# Altium project Industrial Instrumentation Controller.PrjPcb
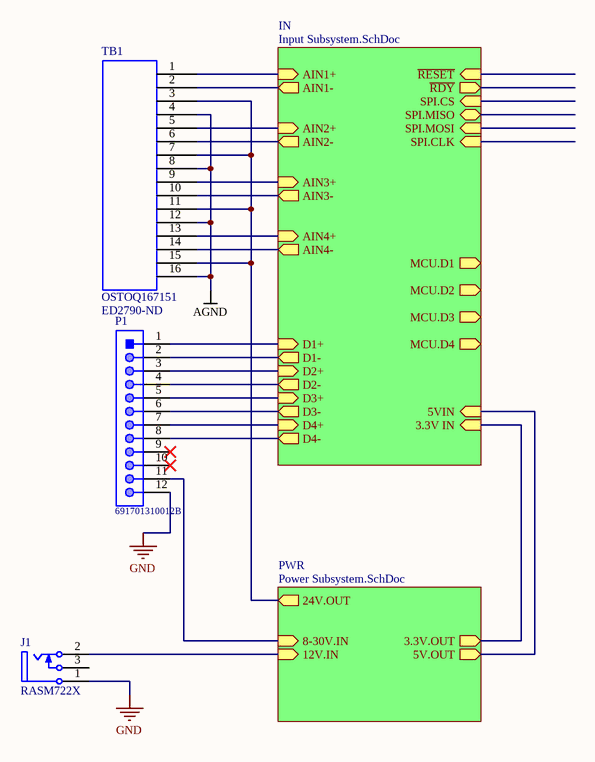
[diagram p0: Industrial Instrumentation Controller.SchDoc]
7 sheets, 128 parts. Net scope: hierarchical (ports join the sheet entries above them; power ports are global).
Board files: PCBSM.PcbDoc, 0PCBSM.PcbDoc
Sheets:
  Industrial Instrumentation Controller.SchDoc
    IN = Input Subsystem.SchDoc
      CH1 = CurrentSensingSM.SchDoc
      CH2 = CurrentSensingSM.SchDoc
      CH3 = CurrentSensingSM.SchDoc
      CH4 = CurrentSensingSM.SchDoc
    PWR = Power Subsystem.SchDoc
      U_24VBuckBoostConverterSM = 24VBuckBoostConverterSM.SchDoc
      U_3.3VBuckConverterSM = 3.3VBuckConverterSM.SchDoc
      U_5VBuckConverterSM = 5VBuckConverterSM.SchDoc

## Sheet Industrial Instrumentation Controller.SchDoc
size A; SheetNumber: 1; SheetTotal: 7

### Parts
J1  RASM722X  [SWIT-RASM722X_V]
P1  691701310012B  [691701310012B]
TB1  OSTOQ167151  Supplier Part Number 1: ED2790-ND  [OSTOQ167151]

### Sub-sheets
IN = Input Subsystem.SchDoc: SPI.CLK (in), SPI.MOSI (in), SPI.MISO (bidir), SPI.CS (in), ~{RDY} (out), ~{RESET} (in), 3.3V IN (in), AIN1+ (in), AIN1- (out), AIN2+ (in), AIN2- (out), AIN3+ (in), AIN3- (out), AIN4+ (in), AIN4- (out), 5VIN (in), D1+ (in), D2+ (in), D3+ (in), D4+ (in), MCU.D1 (out), MCU.D2 (out), MCU.D3 (out), MCU.D4 (out), D1- (out), D2- (out), D3- (out), D4- (out)
PWR = Power Subsystem.SchDoc: 12V.IN (in), 8-30V.IN (in), 5V.OUT (out), 3.3V.OUT (out), 24V.OUT (out)

### Nets
3.3V: sheet IN/3.3V IN, sheet PWR/3.3V.OUT
24V: TB1.3 TB1.7 TB1.11 TB1.15 ; sheet PWR/24V.OUT
AGND: TB1.4 TB1.8 TB1.12 TB1.16
GND: J1.1(SLEEVE) P1.12
NetC3_1: sheet IN/5VIN, sheet PWR/5V.OUT
NetC20_CH1_2: TB1.2 ; sheet IN/AIN1-
NetC20_CH2_2: TB1.6 ; sheet IN/AIN2-
NetC20_CH3_2: TB1.10 ; sheet IN/AIN3-
NetC20_CH4_2: TB1.14 ; sheet IN/AIN4-
NetD1_2: J1.2(TIP) ; sheet PWR/12V.IN
NetD2_2: P1.11 ; sheet PWR/8-30V.IN
NetF1_CH1_1: TB1.1 ; sheet IN/AIN1+
NetF1_CH2_1: TB1.5 ; sheet IN/AIN2+
NetF1_CH3_1: TB1.9 ; sheet IN/AIN3+
NetF1_CH4_1: TB1.13 ; sheet IN/AIN4+
NetP1_1: P1.1 ; sheet IN/D1+
NetP1_2: P1.2 ; sheet IN/D1-
NetP1_3: P1.3 ; sheet IN/D2+
NetP1_4: P1.4 ; sheet IN/D2-
NetP1_5: P1.5 ; sheet IN/D3+
NetP1_6: P1.6 ; sheet IN/D3-
NetP1_7: P1.7 ; sheet IN/D4+
NetP1_8: P1.8 ; sheet IN/D4-

Not connected (* = marked no-connect by the designer): J1 3(SHUNT); P1 9* 10*

### Library data of the parts
J1 = CMP-1772-00002-1: Power Jack, 5 A, 250 V, 3-Pin SMD, RoHS, Bulk; ComponentLink1URL: http://www.switchcraft.com/; ComponentLink2URL: http://www.switchcraft.com/Drawings/rasm732x_cd.pdf; ComponentLink1Description: Manufacturer URL; PackageReference: RASM722X; ComponentLink2Description: Datasheet; DatasheetVersion: Rev. A, 09/2005; PackageDescription: 3-Pin Surface Mount Device, Body 14.5 x 9 mm
P1 = CMP-1502-01991-1: Serie 7013 B - 3.81mm Vertical PCB Header THR Type WR-TBL, 12 pin; Manufacturer: Wurth Elektronik; Gender: Male; Pin Number: 12; Mounting Technology: SMT; Publisher: WurthElektronik; Operating Temperature: -40to105degC; Pitch: 3.81mm; Package Reference: 691701310012B; Packaging: Box; Manufacturer URL: http://www.we-online.de; Datasheet URL: http://katalog.we-online.de/em/datasheet/6917013100xxB.pdf; Part Number: 691701310012B
TB1 = OSTOQ167151: Supplier 1: Digi-Key

## Sheet Input Subsystem.SchDoc
size A; SheetNumber: 6; SheetTotal: 7
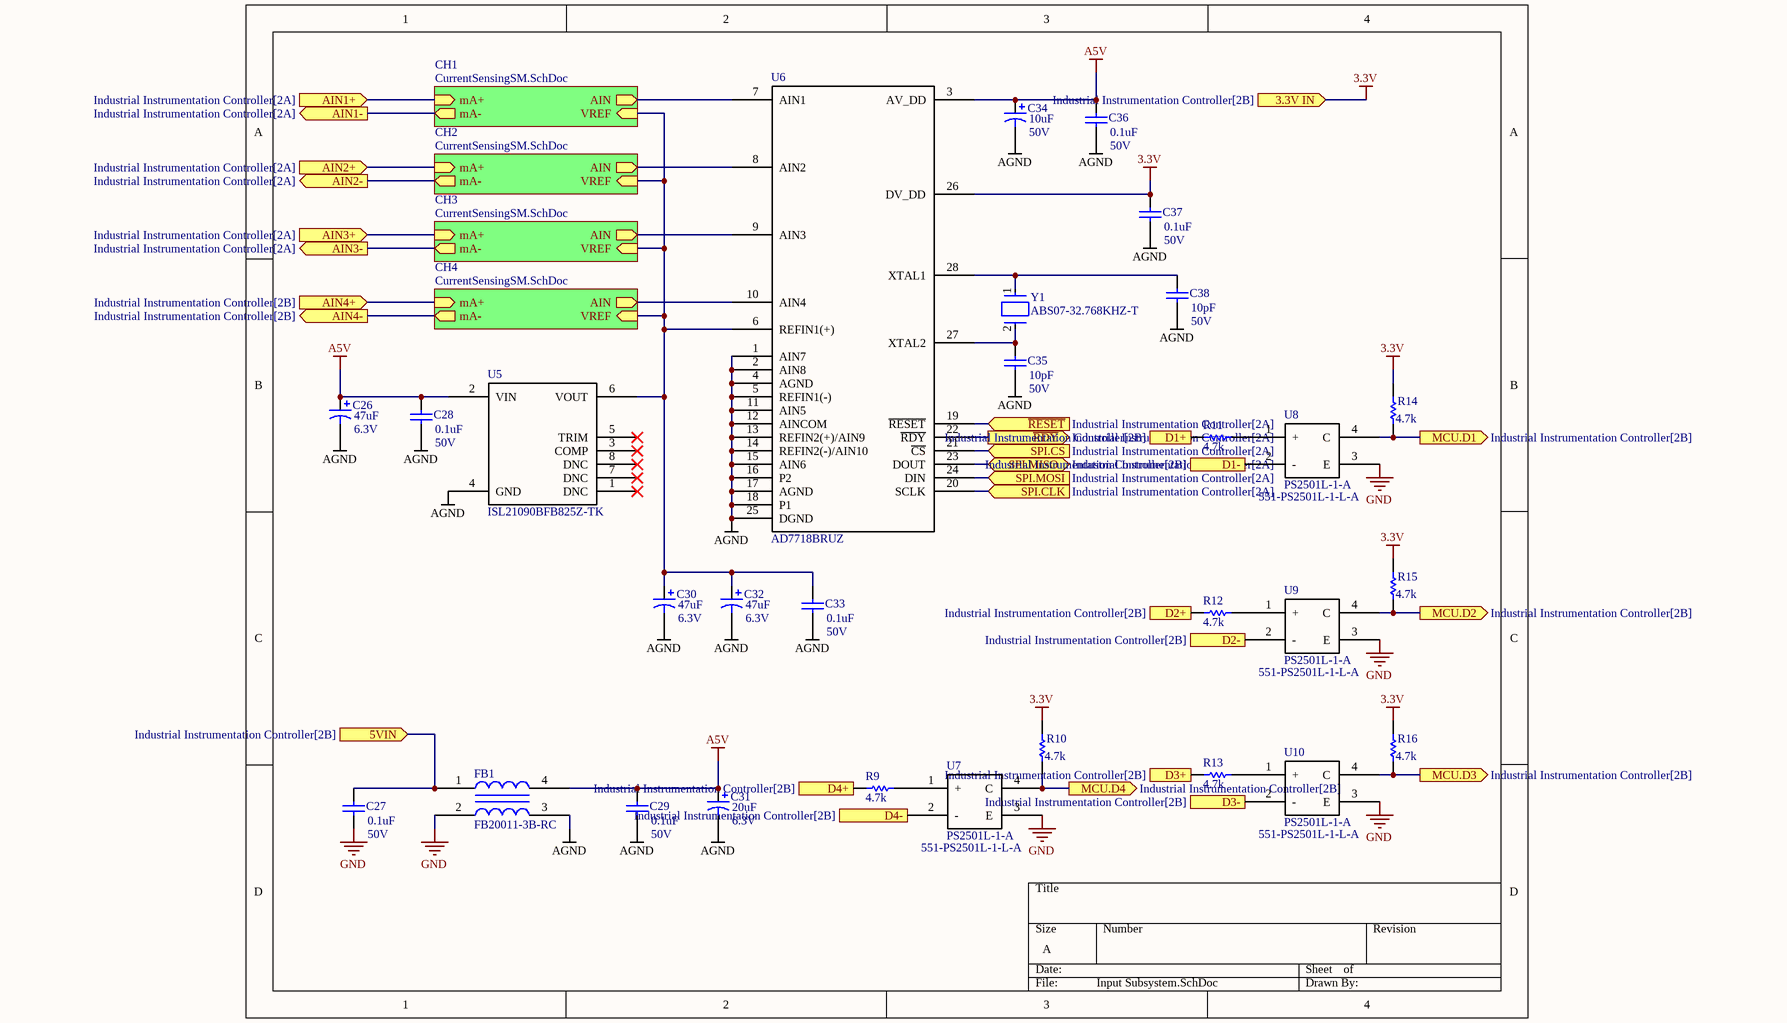
[diagram p1: Input Subsystem.SchDoc]

### Parts
C26  value 47uF  Voltage Rating: 6.3V  [RB7.6-15]  (hidden comment: Cap Pol1)
C27  value 0.1uF  Voltage Rating: 50V  [RAD-0.3]  (hidden comment: Cap)
C28  value 0.1uF  Voltage Rating: 50V  [RAD-0.3]  (hidden comment: Cap)
C29  value 0.1uF  Voltage Rating: 50V  [RAD-0.3]  (hidden comment: Cap)
C30  value 47uF  Voltage Rating: 6.3V  [RB7.6-15]  (hidden comment: Cap Pol1)
C31  value 20uF  Voltage Rating: 6.3V  [RB7.6-15]  (hidden comment: Cap Pol1)
C32  value 47uF  Voltage Rating: 6.3V  [RB7.6-15]  (hidden comment: Cap Pol1)
C33  value 0.1uF  Voltage Rating: 50V  [RAD-0.3]  (hidden comment: Cap)
C34  value 10uF  Voltage Rating: 50V  [RB7.6-15]  (hidden comment: Cap Pol1)
C35  value 10pF  Voltage Rating: 50V  [RAD-0.3]  (hidden comment: Cap)
C36  value 0.1uF  Voltage Rating: 50V  [RAD-0.3]  (hidden comment: Cap)
C37  value 0.1uF  Voltage Rating: 50V  [RAD-0.3]  (hidden comment: Cap)
C38  value 10pF  Voltage Rating: 50V  [RAD-0.3]  (hidden comment: Cap)
FB1  FB20011-3B-RC  [FB20011]
R9  value 4.7k  [AXIAL-0.3]  (hidden comment: Res1)
R10  value 4.7k  [AXIAL-0.3]  (hidden comment: Res1)
R11  value 4.7k  [AXIAL-0.3]  (hidden comment: Res1)
R12  value 4.7k  [AXIAL-0.3]  (hidden comment: Res1)
R13  value 4.7k  [AXIAL-0.3]  (hidden comment: Res1)
R14  value 4.7k  [AXIAL-0.3]  (hidden comment: Res1)
R15  value 4.7k  [AXIAL-0.3]  (hidden comment: Res1)
R16  value 4.7k  [AXIAL-0.3]  (hidden comment: Res1)
U5  ISL21090BFB825Z-TK  [ISL21090BFB825Z-TK]
U6  AD7718BRUZ  [AD7718BRUZ]
U7  PS2501L-1-A  Supplier Part Number 1: 551-PS2501L-1-L-A  [PS2501L-1-A]
U8  PS2501L-1-A  Supplier Part Number 1: 551-PS2501L-1-L-A  [PS2501L-1-A]
U9  PS2501L-1-A  Supplier Part Number 1: 551-PS2501L-1-L-A  [PS2501L-1-A]
U10  PS2501L-1-A  Supplier Part Number 1: 551-PS2501L-1-L-A  [PS2501L-1-A]
Y1  ABS07-32.768KHZ-T  [FP-ABS07-MFG]

### Sub-sheets
CH1 = CurrentSensingSM.SchDoc: mA+ (in), mA- (out), AIN (out), VREF (in)
CH2 = CurrentSensingSM.SchDoc: mA+ (in), mA- (out), AIN (out), VREF (in)
CH3 = CurrentSensingSM.SchDoc: mA+ (in), mA- (out), AIN (out), VREF (in)
CH4 = CurrentSensingSM.SchDoc: mA+ (in), mA- (out), AIN (out), VREF (in)

### Ports
3.3V IN (in, see Industrial Instrumentation Controller[2B]), 5VIN (in, see Industrial Instrumentation Controller[2B]), AIN1+ (in, see Industrial Instrumentation Controller[2A]), AIN1- (out, see Industrial Instrumentation Controller[2A]), AIN2+ (in, see Industrial Instrumentation Controller[2A]), AIN2- (out, see Industrial Instrumentation Controller[2A]), AIN3+ (in, see Industrial Instrumentation Controller[2A]), AIN3- (out, see Industrial Instrumentation Controller[2A]), AIN4+ (in, see Industrial Instrumentation Controller[2B]), AIN4- (out, see Industrial Instrumentation Controller[2B]), D1+ (in, see Industrial Instrumentation Controller[2B]), D1- (out, see Industrial Instrumentation Controller[2B]), D2+ (in, see Industrial Instrumentation Controller[2B]), D2- (out, see Industrial Instrumentation Controller[2B]), D3+ (in, see Industrial Instrumentation Controller[2B]), D3- (out, see Industrial Instrumentation Controller[2B]), D4+ (in, see Industrial Instrumentation Controller[2B]), D4- (out, see Industrial Instrumentation Controller[2B]), MCU.D1 (out, see Industrial Instrumentation Controller[2B]), MCU.D2 (out, see Industrial Instrumentation Controller[2B]), MCU.D3 (out, see Industrial Instrumentation Controller[2B]), MCU.D4 (out, see Industrial Instrumentation Controller[2B]), SPI.CLK (in, see Industrial Instrumentation Controller[2A]), SPI.CS (in, see Industrial Instrumentation Controller[2A]), SPI.MISO (bidir, see Industrial Instrumentation Controller[2A]), SPI.MOSI (in, see Industrial Instrumentation Controller[2A]), ~{RDY} (out, see Industrial Instrumentation Controller[2A]), ~{RESET} (in, see Industrial Instrumentation Controller[2A])

### Nets
3.3V: C37.2 R10.2 R14.2 R15.2 R16.2 U6.26(DV_DD) ; port 3.3V IN
A5V: C26.1 C28.2 C29.2 C31.1 C34.1 C36.2 FB1.4(A5V) U5.2(VIN) U6.3(AV_DD)
AGND: C26.2 C28.1 C29.1 C30.2 C31.2 C32.2 C33.1 C34.2 C35.1 C36.1 C37.1 C38.1 FB1.3(AGND) U5.4(GND) U6.1(AIN7) U6.2(AIN8) U6.4(AGND) U6.5(REFIN1(-)) U6.11(AIN5) U6.12(AINCOM) U6.13(REFIN2(+)/AIN9) U6.14(REFIN2(-)/AIN10) U6.15(AIN6) U6.16(P2) U6.17(AGND) U6.18(P1) U6.25(DGND)
GND: C27.1 FB1.2(GND) U7.3(E) U8.3(E) U9.3(E) U10.3(E)
NetC3_1: C27.2 FB1.1(5V) ; port 5VIN
NetC20_CH1_2: port AIN1-, sheet CH1/mA-
NetC20_CH2_2: port AIN2-, sheet CH2/mA-
NetC20_CH3_2: port AIN3-, sheet CH3/mA-
NetC20_CH4_2: port AIN4-, sheet CH4/mA-
NetC22_CH1_2: C30.1 C32.1 C33.2 U5.6(VOUT) U6.6(REFIN1(+)) ; sheet CH1/VREF, sheet CH2/VREF, sheet CH3/VREF, sheet CH4/VREF
NetC24_CH1_2: U6.7(AIN1) ; sheet CH1/AIN
NetC24_CH2_2: U6.8(AIN2) ; sheet CH2/AIN
NetC24_CH3_2: U6.9(AIN3) ; sheet CH3/AIN
NetC24_CH4_2: U6.10(AIN4) ; sheet CH4/AIN
NetC35_2: C35.2 U6.27(XTAL2) Y1.2
NetC38_2: C38.2 U6.28(XTAL1) Y1.1
NetF1_CH1_1: port AIN1+, sheet CH1/mA+
NetF1_CH2_1: port AIN2+, sheet CH2/mA+
NetF1_CH3_1: port AIN3+, sheet CH3/mA+
NetF1_CH4_1: port AIN4+, sheet CH4/mA+
NetP1_1: R11.2 ; port D1+
NetP1_2: U8.2(-) ; port D1-
NetP1_3: R12.2 ; port D2+
NetP1_4: U9.2(-) ; port D2-
NetP1_5: R13.2 ; port D3+
NetP1_6: U10.2(-) ; port D3-
NetP1_7: R9.2 ; port D4+
NetP1_8: U7.2(-) ; port D4-
NetR9_1: R9.1 U7.1(+)
NetR10_1: R10.1 U7.4(C) ; port MCU.D4
NetR11_1: R11.1 U8.1(+)
NetR12_1: R12.1 U9.1(+)
NetR13_1: R13.1 U10.1(+)
NetR14_1: R14.1 U8.4(C) ; port MCU.D1
NetR15_1: R15.1 U9.4(C) ; port MCU.D2
NetR16_1: R16.1 U10.4(C) ; port MCU.D3
NetU6_19: U6.19(~{RESET}) ; port ~{RESET}
NetU6_20: U6.20(SCLK) ; port SPI.CLK
NetU6_21: U6.21(~{CS}) ; port SPI.CS
NetU6_22: U6.22(~{RDY}) ; port ~{RDY}
NetU6_23: U6.23(DOUT) ; port SPI.MISO
NetU6_24: U6.24(DIN) ; port SPI.MOSI

Not connected (* = marked no-connect by the designer): U5 1(DNC)* 3(COMP)* 5(TRIM)* 7(DNC)* 8(DNC)*

### Library data of the parts
C26 C30-C32 C34 = Cap Pol1: Polarized Capacitor (Radial); Published: 8-Jun-2000; LatestRevisionDate: 17-Jul-2002; LatestRevisionNote: Re-released for DXP Platform.; PackageReference: RB7.6-15; Publisher: Altium Limited; PackageDescription: Polarized Capacitor (Radial); 2 Leads
C27-C29 C33 C35-C38 = Cap: Capacitor; Published: 8-Jun-2000; LatestRevisionDate: 17-Jul-2002; LatestRevisionNote: Re-released for DXP Platform.; PackageReference: RAD-0.3; Publisher: Altium Limited; PackageDescription: Radial Cap, Thru-Hole; 2 Leads; 0.3 in Pin Spacing
FB1 = FB20011
R9-R16 = Res1: Resistor; Published: 8-Jun-2000; LatestRevisionDate: 17-Jul-2002; LatestRevisionNote: Re-released for DXP Platform.; PackageReference: AXIAL-0.3; Publisher: Altium Limited; PackageDescription: Axial Device, Thru-Hole; 2 Leads; 0.3 in Pin Spacing
U7-U10 = PS2501L-1-A: Optocoupler DC-IN 1-CH Transistor DC-OUT 4-Pin PDIP SMD Magazine; Manufacturer: CEL; Manufacturer Part Number: PS2501L-1-L-A; Collector Emitter Voltage (VCEO): 300mV; Input Type: DC; Current Transfer Ratio: 300%; Number of Channels: 1; Max Power Dissipation: 150mW; Forward Current: 10mA; Max Collector Current: 50mA; Isolation Voltage: 5kV; Output Voltage: 80V; Supplier 1: Mouser; RoHS: Yes; Category: Optocouplers; Mount: Surface Mount; Case/Package: SMD/SMT; Min Operating Temperature: -55°C; Max Operating Temperature: 100°C; Packaging: Rail/Tube; Collector Emitter Saturation Voltage: 300mV; Package Quantity: 100; Output Current per Channel: 50mA; Series: NEPOC; Collector-emitter Voltage-Max: 300mV; Lead Free: Lead Free; ComponentLink1URL: https://datasheet.ciiva.com/2088/ps2501-2088124.pdf?src-supplier=Digi-Key; ComponentLink1Description: https://datasheet.ciiva.com/2088/ps2501-2088124.pdf?src-supplier=Digi-Key
Y1 = CMP-0447-00001-4: Crystal 32.768kHz ±20ppm (Tol) 12.5pF FUND 70kΩ 2-Pin CSMD T/R; ESR (Equivalent Series Resistance): 70kR; Radiation Hardening: No; Frequency: 32.768kHz; Length: 3.2mm; Max Operating Temperature: 85°C; Number of Pins: 2; Series: ABS07; Min Operating Temperature: -40°C; Frequency Tolerance: 20ppm; Packaging: Tape and Reel; Height: 0.9mm; Width: 1.5mm; Depth: 1.5mm; Load Capacitance: 12.5pF; RoHS Compliant: Yes; Tolerance: 20ppm; Termination: SMD/SMT; Lead Free: Lead Free; Series Resistance: 70kR; REACH SVHC: No SVHC; Case/Package: CSMD; Operating Frequency: 32.768 kHz; Package Quantity: 3000

## Sheet CurrentSensingSM.SchDoc
size A; SheetNumber: 7; SheetTotal: 7
Used 4 times, as channels IN/CH1, IN/CH2, IN/CH3, IN/CH4. Parts and nets are listed once, with the designators drawn on the sheet.
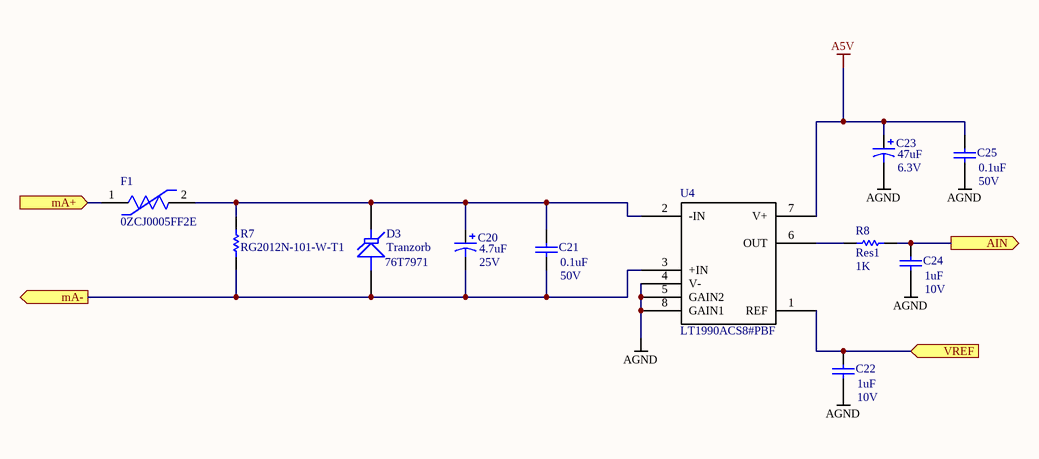
[diagram p2: CurrentSensingSM.SchDoc]

### Parts
C20  value 4.7uF  Voltage Rating: 25V  [RB7.6-15]  (hidden comment: Cap Pol1)
C21  value 0.1uF  Voltage Rating: 50V  [RAD-0.3]  (hidden comment: Cap)
C22  value 1uF  Voltage Rating: 10V  [RAD-0.3]  (hidden comment: Cap)
C23  value 47uF  Voltage Rating: 6.3V  [RB7.6-15]  (hidden comment: Cap Pol1)
C24  value 1uF  Voltage Rating: 10V  [RAD-0.3]  (hidden comment: Cap)
C25  value 0.1uF  Voltage Rating: 50V  [RAD-0.3]  (hidden comment: Cap)
D3  Tranzorb  Supplier Part Number 1: 76T7971  [SZ1SMB36CAT3G]
F1  0ZCJ0005FF2E  [FP-0ZCJ0005FF2E-MFG]
R7  RG2012N-101-W-T1  [RESC2013X50X40ML20T20]
R8  Res1  value 1K  [AXIAL-0.3]
U4  LT1990ACS8#PBF  [LT1990ACS8-PBF]

### Ports
AIN (out), mA+ (in), mA- (out), VREF (in)

### Nets
A5V: C23.1 C25.2 U4.7(V+)
AGND: C22.1 C23.2 C24.1 C25.1 U4.4(V-) U4.5(GAIN2) U4.8(GAIN1)
AIN: C24.2 R8.2 ; port AIN
mA+: F1.1 ; port mA+
mA-: C20.2 C21.1 D3.1(A) R7.1 U4.3(+IN) ; port mA-
VREF: C22.2 U4.1(REF) ; port VREF
NetC20_1: C20.1 C21.2 D3.2(K) F1.2 R7.2 U4.2(-IN)
NetR8_1: R8.1 U4.6(OUT)

### Channels
IN/CH1: designators end in _CH1; ports AIN=NetC24_CH1_2 mA+=NetF1_CH1_1 mA-=NetC20_CH1_2 VREF=NetC22_CH1_2
IN/CH2: designators end in _CH2; ports AIN=NetC24_CH2_2 mA+=NetF1_CH2_1 mA-=NetC20_CH2_2 VREF=NetC22_CH1_2
IN/CH3: designators end in _CH3; ports AIN=NetC24_CH3_2 mA+=NetF1_CH3_1 mA-=NetC20_CH3_2 VREF=NetC22_CH1_2
IN/CH4: designators end in _CH4; ports AIN=NetC24_CH4_2 mA+=NetF1_CH4_1 mA-=NetC20_CH4_2 VREF=NetC22_CH1_2

### Library data of the parts
C20 C23 = Cap Pol1: Polarized Capacitor (Radial); Published: 8-Jun-2000; LatestRevisionDate: 17-Jul-2002; LatestRevisionNote: Re-released for DXP Platform.; PackageReference: RB7.6-15; Publisher: Altium Limited; PackageDescription: Polarized Capacitor (Radial); 2 Leads
C21 C22 C24 C25 = Cap: Capacitor; Published: 8-Jun-2000; LatestRevisionDate: 17-Jul-2002; LatestRevisionNote: Re-released for DXP Platform.; PackageReference: RAD-0.3; Publisher: Altium Limited; PackageDescription: Radial Cap, Thru-Hole; 2 Leads; 0.3 in Pin Spacing
D3 = Tranzorb: 1SMB Series 600 W 36 V Bi-Directional Surface Mount TVS Diode - DO-214AA; Manufacturer: ON Semiconductor; Direction: Bidirectional; Reverse Breakdown Voltage: 40V; Number of Bidirectional Channels: 1; Reverse Standoff Voltage: 36V; Clamping Voltage: 58.1V; Peak Pulse Power: 600W; Power Line Protection: No; Peak Pulse Current: 10.3A; Test Current: 1mA; ESD Protection: Yes; Max Reverse Leakage Current: 5uA; Element Configuration: Single; Diode Type: ZENER; Published: 24-Mar-1999; LatestRevisionDate: 17-Jul-2002; LatestRevisionNote: Re-released for DXP Platform.; PackageReference: DO-7; Publisher: Altium Limited; PackageDescription: Axial Lead Diode; Supplier 1: Newark; Manufacturer Part Number: SZ1SMB36CAT3G; RoHS: Yes; Category: TVS Diodes; Mount: Surface Mount; Case/Package: SMB; Number of Pins: 2; Min Operating Temperature: -65°C; Max Operating Temperature: 150°C; Packaging: Tape and Reel; Package Quantity: 2500; Min Breakdown Voltage: 40V; Polarity: Bidirectional; Number of Elements: 1; Max Power Dissipation: 600W; Leakage Current: 5uA; Breakdown Voltage: 40V; Resistor Type: Zener; Series: Automotive, AEC-Q101; Length: 4.57mm; Width: 3.81mm; Height: 2.41mm; RoHS Compliant: Yes; Lead Free: Lead Free; ComponentLink1URL: https://datasheet.ciiva.com/11313/1smb10cat3-d-11313549.pdf?src-supplier=Avnet; ComponentLink1Description: https://datasheet.ciiva.com/11313/1smb10cat3-d-11313549.pdf?src-supplier=Avnet; ComponentLink2URL: https://datasheet.ciiva.com/354/1smb10cat3-d-354502.pdf?src-supplier=Digi-Key; ComponentLink2Description: https://datasheet.ciiva.com/354/1smb10cat3-d-354502.pdf?src-supplier=Digi-Key
F1 = CMP-16043-000008-1: PTC RESET FUSE 60V 50MA 1206; Time to Trip: 1.5s; Max Current Rating: 10A; Number of Terminals/Pins: 2; Trip Current: 150mA; Power Dissipation: 400mW; Approvals: UL; Contact Plating: Tin; Hold Current: 50mA; Max Voltage Rating (DC): 60V; Packaging: Tape and Reel; Case/Package: 1206; Case Code (Imperial): 1206; Package Quantity: 1; Mount: Surface Mount; Min Operating Temperature: -40°C; Max Operating Temperature: 85°C; Case Code (Metric): 3216; RoHS Compliant: Yes; Lead Free: Lead Free
R7 = CMP-2001-04796-1: Manufacturer: Susumu; Value: 100; Part Number: RG2012N-101-W-T1
R8 = Res1: Resistor; Published: 8-Jun-2000; LatestRevisionDate: 17-Jul-2002; LatestRevisionNote: Re-released for DXP Platform.; PackageReference: AXIAL-0.3; Publisher: Altium Limited; PackageDescription: Axial Device, Thru-Hole; 2 Leads; 0.3 in Pin Spacing

## Sheet Power Subsystem.SchDoc
size A; SheetNumber: 2; SheetTotal: 7
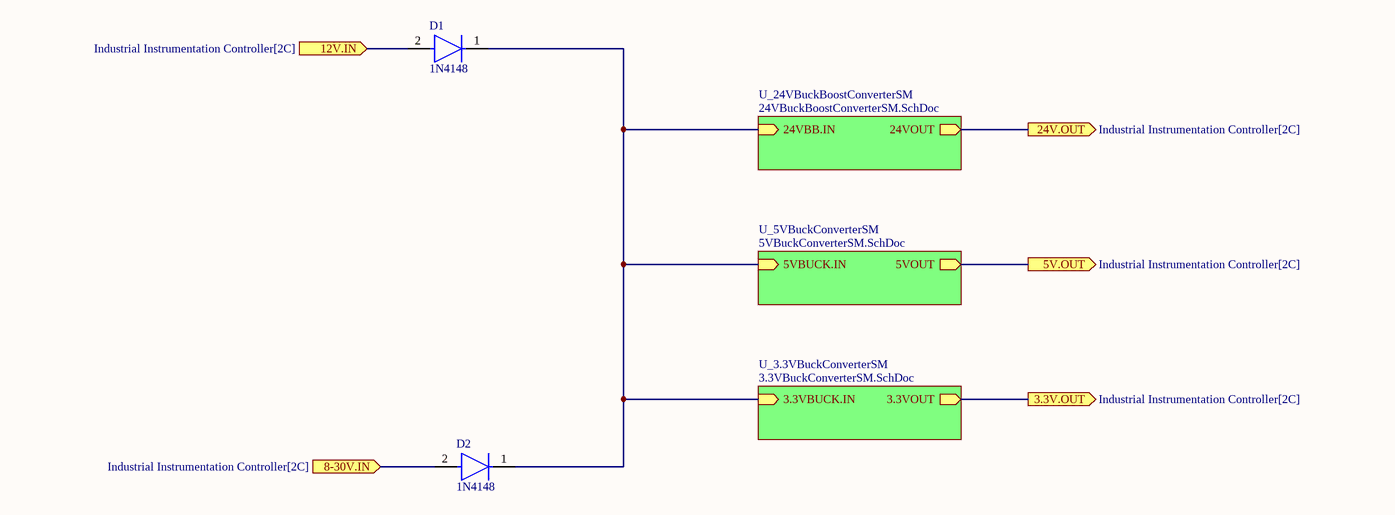
[diagram p3: Power Subsystem.SchDoc]

### Parts
D1  1N4148  [FP-017AG-MFG]
D2  1N4148  [FP-017AG-MFG]

### Sub-sheets
U_3.3VBuckConverterSM = 3.3VBuckConverterSM.SchDoc: 3.3VOUT (out), 3.3VBUCK.IN (in)
U_5VBuckConverterSM = 5VBuckConverterSM.SchDoc: 5VOUT (out), 5VBUCK.IN (in)
U_24VBuckBoostConverterSM = 24VBuckBoostConverterSM.SchDoc: 24VOUT (out), 24VBB.IN (in)

### Ports
3.3V.OUT (out, see Industrial Instrumentation Controller[2C]), 5V.OUT (out, see Industrial Instrumentation Controller[2C]), 8-30V.IN (in, see Industrial Instrumentation Controller[2C]), 12V.IN (in, see Industrial Instrumentation Controller[2C]), 24V.OUT (out, see Industrial Instrumentation Controller[2C])

### Nets
3.3V: port 3.3V.OUT, sheet U_3.3VBuckConverterSM/3.3VOUT
8-30V: D1.1(C) D2.1(C) ; sheet U_24VBuckBoostConverterSM/24VBB.IN, sheet U_3.3VBuckConverterSM/3.3VBUCK.IN, sheet U_5VBuckConverterSM/5VBUCK.IN
24V: port 24V.OUT, sheet U_24VBuckBoostConverterSM/24VOUT
NetC3_1: port 5V.OUT, sheet U_5VBuckConverterSM/5VOUT
NetD1_2: D1.2(A) ; port 12V.IN
NetD2_2: D2.2(A) ; port 8-30V.IN

### Library data of the parts
D1 D2 = CMP-07163-000046-1: DIODE GEN PURP 100V 200MA DO35; Forward Voltage: 1V; Max Power Dissipation: 500mW; Max Reverse Current: 5uA; Forward Current: 300mA; Current: 4A; Reverse Recovery Time: 4ns; Element Configuration: Single; Outside Diameter: 1.85mm; Capacitance: 4pF; Polarity: Standard; Max Forward Surge Current (Ifsm): 1A; Reverse Voltage: 100V; Output Current: 200mA; Average Rectified Current: 200mA; Diameter: 1.91mm; Max Repetitive Reverse Voltage (Vrrm): 100V; Current Rating: 200mA; Case/Package: DO-35; Lead Free: Lead Free; Number of Pins: 2; Recovery Time: 4ns; Packaging: Bulk; Contact Plating: Tin; Voltage: 100V; Mount: Through Hole; Max Surge Current: 4A; Package Quantity: 2000; Width: 1.91mm; Max Reverse Voltage (DC): 100V; Length: 4.56mm; Radiation Hardening: No; Power Dissipation: 500mW; Voltage Rating (DC): 100V; Peak Non-Repetitive Surge Current: 4A; REACH SVHC: No SVHC; Height: 4.56mm; Max Operating Temperature: 175°C; Series: -; Weight: 0.01lb; Min Operating Temperature: -65°C

## Sheet 24VBuckBoostConverterSM.SchDoc
size A; SheetNumber: 5; SheetTotal: 7; SPICEModelCacheDWFIXPQE: <root> / <DocumentId>DWFIXPQE</DocumentId> / </root>
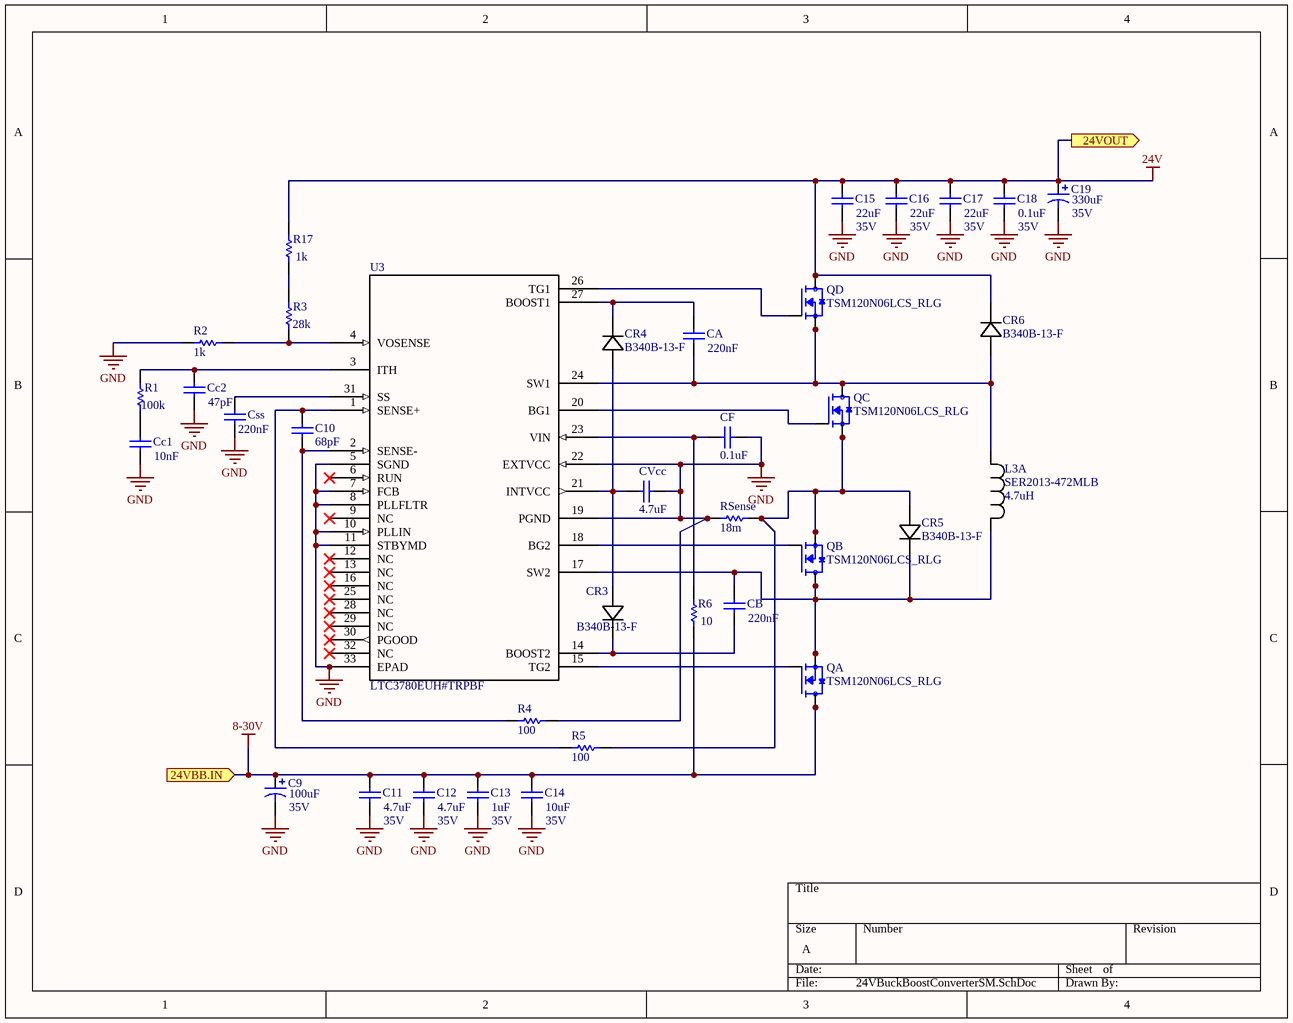
[diagram p4: 24VBuckBoostConverterSM.SchDoc]

### Parts
C9  value 100uF  Voltage Rating: 35V  [RB7.6-15]  (hidden comment: Cap Pol1)
C10  value 68pF  [RAD-0.1]  (hidden comment: Cap)
C11  value 4.7uF  Voltage Rating: 35V  [RAD-0.3]  (hidden comment: Cap)
C12  value 4.7uF  Voltage Rating: 35V  [RAD-0.3]  (hidden comment: Cap)
C13  value 1uF  Voltage Rating: 35V  [RAD-0.3]  (hidden comment: Cap)
C14  value 10uF  Voltage Rating: 35V  [RAD-0.3]  (hidden comment: Cap)
C15  value 22uF  Voltage Rating: 35V  [RAD-0.3]  (hidden comment: Cap)
C16  value 22uF  Voltage Rating: 35V  [RAD-0.3]  (hidden comment: Cap)
C17  value 22uF  Voltage Rating: 35V  [RAD-0.3]  (hidden comment: Cap)
C18  value 0.1uF  Voltage Rating: 35V  [RAD-0.3]  (hidden comment: Cap)
C19  value 330uF  Voltage Rating: 35V  [RB7.6-15]  (hidden comment: Cap Pol1)
CA  value 220nF  [RAD-0.1]  (hidden comment: Cap)
CB  value 220nF  [RAD-0.1]  (hidden comment: Cap)
Cc1  value 10nF  [RAD-0.1]  (hidden comment: Cap)
Cc2  value 47pF  [RAD-0.2]  (hidden comment: Cap)
CF  value 0.1uF  [RAD-0.1]  (hidden comment: Cap)
CR3  B340B-13-F  [B340A-13-F]
CR4  B340B-13-F  [B340A-13-F]
CR5  B340B-13-F  [B340A-13-F]
CR6  B340B-13-F  [B340A-13-F]
Css  value 220nF  [RAD-0.1]  (hidden comment: Cap)
CVcc  value 4.7uF  [RAD-0.1]  (hidden comment: Cap)
L3  SER2013-472MLB  value 4.7uH  [SER2013-472MLB]  (part A of 3)
QA  TSM120N06LCS_RLG  [SOP127P600X200-8N]
QB  TSM120N06LCS_RLG  [SOP127P600X200-8N]
QC  TSM120N06LCS_RLG  [SOP127P600X200-8N]
QD  TSM120N06LCS_RLG  [SOP127P600X200-8N]
R1  value 100k  [AXIAL-0.3]  (hidden comment: Res1)
R2  value 1k  [AXIAL-0.3]  (hidden comment: Res1)
R3  value 28k  [AXIAL-0.3]  (hidden comment: Res1)
R4  value 100  [AXIAL-0.3]  (hidden comment: Res1)
R5  value 100  [AXIAL-0.3]  (hidden comment: Res1)
R6  value 10  [AXIAL-0.3]  (hidden comment: Res1)
R17  value 1k  [AXIAL-0.3]  (hidden comment: Res1)
RSense  value 18m  [AXIAL-0.3]  (hidden comment: Res1)
U3  LTC3780EUH#TRPBF  [LTC3780EUH]

### Ports
24VBB.IN (in), 24VOUT (out)

### Nets
8-30V: C9.1 C11.2 C12.2 C13.2 C14.2 QA.5(D) QA.6(D) QA.7(D) QA.8(D) R6.1 ; port 24VBB.IN
24V: C15.2 C16.2 C17.2 C18.2 C19.1 CR6.1 QD.5(D) QD.6(D) QD.7(D) QD.8(D) R17.2 ; port 24VOUT
GND: C9.2 C11.1 C12.1 C13.1 C14.1 C15.1 C16.1 C17.1 C18.1 C19.2 Cc1.1 Cc2.1 CF.1 Css.1 CVcc.1 R2.2 R4.1 RSense.2 U3.5(SGND) U3.7(FCB) U3.8(PLLFLTR) U3.10(PLLIN) U3.11(STBYMD) U3.19(PGND) U3.22(EXTVCC) U3.33(EPAD)
NetC10_1: C10.1 R5.2 U3.1(SENSE+)
NetC10_2: C10.2 R4.2 U3.2(SENSE-)
NetCA_1: CA.1 CR6.2 L3.2 QC.5(D) QC.6(D) QC.7(D) QC.8(D) QD.1(S) QD.2(S) QD.3(S) U3.24(SW1)
NetCA_2: CA.2 CR4.1 U3.27(BOOST1)
NetCB_1: CB.1 CR3.1 U3.14(BOOST2)
NetCB_2: CB.2 CR5.1 L3.1 QA.1(S) QA.2(S) QA.3(S) QB.5(D) QB.6(D) QB.7(D) QB.8(D) U3.17(SW2)
NetCc1_2: Cc1.2 R1.1
NetCc2_2: Cc2.2 R1.2 U3.3(ITH)
NetCF_2: CF.2 R6.2 U3.23(VIN)
NetCR3_2: CR3.2 CR4.2 CVcc.2 U3.21(INTVCC)
NetCR5_2: CR5.2 QB.1(S) QB.2(S) QB.3(S) QC.1(S) QC.2(S) QC.3(S) R5.1 RSense.1
NetCss_2: Css.2 U3.31(SS)
NetQA_4: QA.4(G) U3.15(TG2)
NetQB_4: QB.4(G) U3.18(BG2)
NetQC_4: QC.4(G) U3.20(BG1)
NetQD_4: QD.4(G) U3.26(TG1)
NetR2_1: R2.1 R3.1 U3.4(VOSENSE)
NetR3_2: R3.2 R17.1

Not connected (* = marked no-connect by the designer): U3 6(RUN)* 9(NC)* 12(NC)* 13(NC)* 16(NC)* 25(NC)* 28(NC)* 29(NC)* 30(PGOOD)* 32(NC)*

### Library data of the parts
C9 C19 = Cap Pol1: Polarized Capacitor (Radial); Published: 8-Jun-2000; LatestRevisionDate: 17-Jul-2002; LatestRevisionNote: Re-released for DXP Platform.; PackageReference: RB7.6-15; Publisher: Altium Limited; PackageDescription: Polarized Capacitor (Radial); 2 Leads
C10-C18 CA CB Cc1 Cc2 CF Css CVcc = Cap: Capacitor; Published: 8-Jun-2000; LatestRevisionDate: 17-Jul-2002; LatestRevisionNote: Re-released for DXP Platform.; PackageReference: RAD-0.3; Publisher: Altium Limited; PackageDescription: Radial Cap, Thru-Hole; 2 Leads; 0.3 in Pin Spacing
CR3-CR6 = B340B-13-F: No Description Available; Mfr_Name: Diodes Inc; Type: DEV; Copyright: Copyright (C) 2022 Ultra Librarian. All rights reserved.; Manufacturer_Part_Number: B340B-13-F; Digi-Key_Part_Number_1: B340B-FDITR-ND; Digi-Key_Part_Number_2: B340B-FDIDKR-ND; Digi-Key_Part_Number_3: B340B-FDICT-ND; RefDes: RefDes
L3 = SER2013-472MLB: No Description Available; Mfr_Name: Coilcraft; Type: DEV; Copyright: Copyright (C) 2022 Ultra Librarian. All rights reserved.; Manufacturer_Part_Number: SER2013-472MLB; RefDes: RefDes
QA QB QC QD = TSM120N06LCS_RLG: 60V, 23A, Single N-Channel Power MOSFET; MF: Taiwan Semiconductor; MP: TSM120N06LCS RLG; Value: *; Purchase-URL: https://pricing.snapeda.com/search/part/TSM120N06LCS RLG/?ref=eda; Digi-Key_Part_Number: TSM120N06LCSRLGTR-ND; Package: SOP-8 Taiwan Semiconductor; SnapEDA_Link: https://www.snapeda.com/parts/TSM120N06LCS%20RLG/Taiwan+Semiconductor/view-part/?ref=snap; Check_prices: https://www.snapeda.com/parts/TSM120N06LCS%20RLG/Taiwan+Semiconductor/view-part/?ref=eda
R1-R6 R17 RSense = Res1: Resistor; Published: 8-Jun-2000; LatestRevisionDate: 17-Jul-2002; LatestRevisionNote: Re-released for DXP Platform.; PackageReference: AXIAL-0.3; Publisher: Altium Limited; PackageDescription: Axial Device, Thru-Hole; 2 Leads; 0.3 in Pin Spacing

## Sheet 3.3VBuckConverterSM.SchDoc
size A; SheetNumber: 4; SheetTotal: 7; SPICEModelCacheJBXWNVDI: <root> / <DocumentId>JBXWNVDI</DocumentId> / </root>
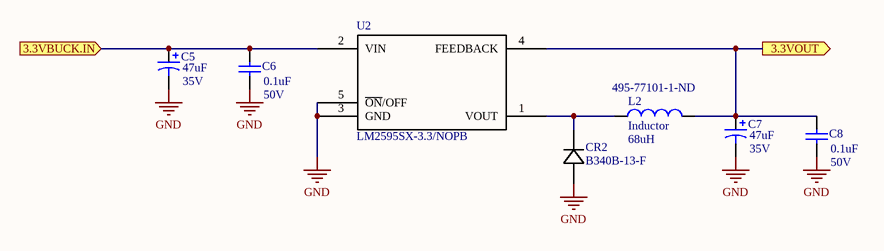
[diagram p5: 3.3VBuckConverterSM.SchDoc]

### Parts
C5  value 47uF  Voltage Rating: 35V  [RB7.6-15]  (hidden comment: Cap Pol1)
C6  value 0.1uF  Voltage Rating: 50V  [RAD-0.3]  (hidden comment: Cap)
C7  value 47uF  Voltage Rating: 35V  [RB7.6-15]  (hidden comment: Cap Pol1)
C8  value 0.1uF  Voltage Rating: 50V  [RAD-0.3]  (hidden comment: Cap)
CR2  B340B-13-F  [B340A-13-F]
L2  Inductor  value 68uH  Supplier Part Number 1: 495-77101-1-ND  [B82472P6683M000]
U2  LM2595SX-3.3/NOPB  [LM2595SX-3P3]

### Ports
3.3VBUCK.IN (in), 3.3VOUT (out)

### Nets
3.3V: C7.1 C8.2 L2.2 U2.4(FEEDBACK) ; port 3.3VOUT
8-30V: C5.1 C6.2 U2.2(VIN) ; port 3.3VBUCK.IN
GND: C5.2 C6.1 C7.2 C8.1 CR2.2 U2.3(GND) U2.5(~{ON}/OFF)
NetCR2_1: CR2.1 L2.1 U2.1(VOUT)

### Library data of the parts
C5 C7 = Cap Pol1: Polarized Capacitor (Radial); Published: 8-Jun-2000; LatestRevisionDate: 17-Jul-2002; LatestRevisionNote: Re-released for DXP Platform.; PackageReference: RB7.6-15; Publisher: Altium Limited; PackageDescription: Polarized Capacitor (Radial); 2 Leads
C6 C8 = Cap: Capacitor; Published: 8-Jun-2000; LatestRevisionDate: 17-Jul-2002; LatestRevisionNote: Re-released for DXP Platform.; PackageReference: RAD-0.3; Publisher: Altium Limited; PackageDescription: Radial Cap, Thru-Hole; 2 Leads; 0.3 in Pin Spacing
CR2 = B340B-13-F: as CR3 on sheet 24VBuckBoostConverterSM; Copyright: Copyright (C) 2022 Ultra Librarian. All rights reserved.; Manufacturer_Part_Number: B340B-13-F; Digi-Key_Part_Number_1: B340B-FDITR-ND; Digi-Key_Part_Number_2: B340B-FDIDKR-ND; Digi-Key_Part_Number_3: B340B-FDICT-ND; RefDes: RefDes
L2 = Inductor: Ind Power Shielded Wirewound 68uH 20% 100KHz Ferrite 820mA Blister T/R; Manufacturer: TDK EPCOS; Code_IEC: 1005; Max DC Current: 680mA; DC Resistance (DCR): 260mR; Published: 8-Jun-2000; LatestRevisionDate: 29-May-2009; LatestRevisionNote: IPC-7351 Footprint Added.; PackageReference: 0402-A; Publisher: Altium Limited; PackageDescription: Chip Inductor; Code_JEITA: 0402; Supplier 1: Digi-Key; Manufacturer Part Number: B82472P6683M000; RoHS: Yes; Category: Fixed Inductors; Stock 1: 3192; Pricing 1: 1=1.69000, 10=1.56600, 25=1.44520, 50=1.20440, 100=1.13220, 250=1.01172, 500=0.86718 (USD); Case/Package: SMD/SMT; Core Material: Ferrite; Weight: 0.052911oz; Package Quantity: 1000; Tolerance: 20%; Packaging: Tape and Reel; Shielding: Shielded; Inductance: 68uH; Termination: SMD/SMT; Test Frequency: 100kHz; DC Current: 820mA; Series: B82472P6; Length: 7.5mm; Depth: 7.5mm; Military Standard: Not; RoHS Compliant: Yes; ComponentLink1URL: https://datasheet.ciiva.com/13285/b82472g6-525414-13285823.pdf?src-supplier=Mouser; ComponentLink1Description: https://datasheet.ciiva.com/13285/b82472g6-525414-13285823.pdf?src-supplier=Mouser

## Sheet 5VBuckConverterSM.SchDoc
size A; SheetNumber: 3; SheetTotal: 7; SPICEModelCacheJBXWNVDI: <root> / <DocumentId>JBXWNVDI</DocumentId> / </root>
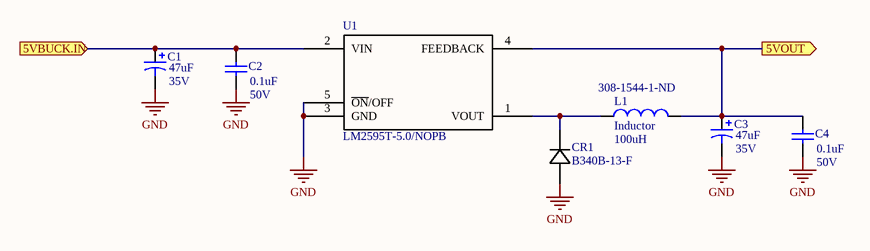
[diagram p6: 5VBuckConverterSM.SchDoc]

### Parts
C1  value 47uF  Voltage Rating: 35V  [RB7.6-15]  (hidden comment: Cap Pol1)
C2  value 0.1uF  Voltage Rating: 50V  [RAD-0.3]  (hidden comment: Cap)
C3  value 47uF  Voltage Rating: 35V  [RB7.6-15]  (hidden comment: Cap Pol1)
C4  value 0.1uF  Voltage Rating: 50V  [RAD-0.3]  (hidden comment: Cap)
CR1  B340B-13-F  [B340A-13-F]
L1  Inductor  value 100uH  Supplier Part Number 1: 308-1544-1-ND  [0402-A]
U1  LM2595T-5.0/NOPB  [LM2595ST-5P0]

### Ports
5VBUCK.IN (in), 5VOUT (out)

### Nets
8-30V: C1.1 C2.2 U1.2(VIN) ; port 5VBUCK.IN
GND: C1.2 C2.1 C3.2 C4.1 CR1.2 U1.3(GND) U1.5(~{ON}/OFF)
NetC3_1: C3.1 C4.2 L1.2 U1.4(FEEDBACK) ; port 5VOUT
NetCR1_1: CR1.1 L1.1 U1.1(VOUT)

### Library data of the parts
C1 C3 = Cap Pol1: Polarized Capacitor (Radial); Published: 8-Jun-2000; LatestRevisionDate: 17-Jul-2002; LatestRevisionNote: Re-released for DXP Platform.; PackageReference: RB7.6-15; Publisher: Altium Limited; PackageDescription: Polarized Capacitor (Radial); 2 Leads
C2 C4 = Cap: Capacitor; Published: 8-Jun-2000; LatestRevisionDate: 17-Jul-2002; LatestRevisionNote: Re-released for DXP Platform.; PackageReference: RAD-0.3; Publisher: Altium Limited; PackageDescription: Radial Cap, Thru-Hole; 2 Leads; 0.3 in Pin Spacing
CR1 = B340B-13-F: as CR3 on sheet 24VBuckBoostConverterSM; Copyright: Copyright (C) 2022 Ultra Librarian. All rights reserved.; Manufacturer_Part_Number: B340B-13-F; Digi-Key_Part_Number_1: B340B-FDITR-ND; Digi-Key_Part_Number_2: B340B-FDIDKR-ND; Digi-Key_Part_Number_3: B340B-FDICT-ND; RefDes: RefDes
L1 = Inductor: Ind Power Shielded Wirewound 100uH 20% 100KHz 1.6A Carrier T/R; Manufacturer: Sumida; Manufacturer Part Number: CDRH125/LDNP-101MC; Code_IEC: 1005; Core Material: Ferrite; DC Resistance (DCR): 187mR; Published: 8-Jun-2000; LatestRevisionDate: 29-May-2009; LatestRevisionNote: IPC-7351 Footprint Added.; PackageReference: 0402-A; Publisher: Altium Limited; PackageDescription: Chip Inductor; Code_JEITA: 0402; Supplier 1: Digi-Key; RoHS: Yes; Category: Fixed Inductors; Stock 1: 1012; Pricing 1: 1=1.46000, 10=1.35800, 25=1.25360, 50=1.04480, 100=0.98210, 250=0.87760 (USD); Mount: Surface Mount; Case/Package: Nonstandard; Min Operating Temperature: -40°C; Max Operating Temperature: 100°C; Current Rating: 1.6A; Packaging: Tape and Reel; Tolerance: 20%; Package Quantity: 1; Shielding: Shielded; Inductance: 100uH; Test Frequency: 100kHz; Max DC Current: 1.6A; Termination: SMD/SMT; Series: CDRH125/LD; Rated Current-Max: 1.6A; Length: 0.472inch; Width: 0.472inch; Height: 6mm; Height - Seated (Max): 0.236inch; Depth: 12.3mm; Radiation Hardening: No; Lead Free: Lead Free; RoHS Compliant: Yes; ComponentLink1URL: http://www.mouser.com/ds/2/390/CDRH125LD-523473.pdf?src-supplier=Mouser; ComponentLink1Description: http://www.mouser.com/ds/2/390/CDRH125LD-523473.pdf?src-supplier=Mouser; ComponentLink2URL: http://products.sumida.com/products/pdf/CDRH125,CDRH125LD.pdf?src-supplier=Digi-Key; ComponentLink2Description: http://products.sumida.com/products/pdf/CDRH125,CDRH125LD.pdf?src-supplier=Digi-Key; ComponentLink3URL: http://www.sumida.com/products/pdf/CDRH125,CDRH125LD.pdf?src-supplier=Avnet; ComponentLink3Description: http://www.sumida.com/products/pdf/CDRH125,CDRH125LD.pdf?src-supplier=Avnet; ComponentLink4URL: http://www.sumida.com/products/pdf/CDRH125,CDRH125LD.pdf?src-supplier=Future+Electronics; ComponentLink4Description: http://www.sumida.com/products/pdf/CDRH125,CDRH125LD.pdf?src-supplier=Future+Electronics

## Nets that join several sheets
3.3V: Input Subsystem (6 pins), 3.3VBuckConverterSM (C7.1 C8.2 L2.2 U2.4)
8-30V: Power Subsystem (D1.1 D2.1), 24VBuckBoostConverterSM (10 pins), 3.3VBuckConverterSM (C5.1 C6.2 U2.2), 5VBuckConverterSM (C1.1 C2.2 U1.2)
24V: Industrial Instrumentation Controller (TB1.3 TB1.7 TB1.11 TB1.15), 24VBuckBoostConverterSM (11 pins)
A5V: Input Subsystem (9 pins), IN/CH1 (C23_CH1.1 C25_CH1.2 U4_CH1.7), IN/CH2 (C23_CH2.1 C25_CH2.2 U4_CH2.7), IN/CH3 (C23_CH3.1 C25_CH3.2 U4_CH3.7), IN/CH4 (C23_CH4.1 C25_CH4.2 U4_CH4.7)
AGND: Industrial Instrumentation Controller (TB1.4 TB1.8 TB1.12 TB1.16), Input Subsystem (27 pins), IN/CH1 (7 pins), IN/CH2 (7 pins), IN/CH3 (7 pins), IN/CH4 (7 pins)
GND: Industrial Instrumentation Controller (J1.1 P1.12), Input Subsystem (6 pins), 24VBuckBoostConverterSM (26 pins), 3.3VBuckConverterSM (7 pins), 5VBuckConverterSM (7 pins)
NetC3_1: Input Subsystem (C27.2 FB1.1), 5VBuckConverterSM (C3.1 C4.2 L1.2 U1.4)
NetC20_CH1_2: Industrial Instrumentation Controller (TB1.2), IN/CH1 (5 pins)
NetC20_CH2_2: Industrial Instrumentation Controller (TB1.6), IN/CH2 (5 pins)
NetC20_CH3_2: Industrial Instrumentation Controller (TB1.10), IN/CH3 (5 pins)
NetC20_CH4_2: Industrial Instrumentation Controller (TB1.14), IN/CH4 (5 pins)
NetC22_CH1_2: Input Subsystem (5 pins), IN/CH1 (C22_CH1.2 U4_CH1.1), IN/CH2 (C22_CH2.2 U4_CH2.1), IN/CH3 (C22_CH3.2 U4_CH3.1), IN/CH4 (C22_CH4.2 U4_CH4.1)
NetC24_CH1_2: Input Subsystem (U6.7), IN/CH1 (C24_CH1.2 R8_CH1.2)
NetC24_CH2_2: Input Subsystem (U6.8), IN/CH2 (C24_CH2.2 R8_CH2.2)
NetC24_CH3_2: Input Subsystem (U6.9), IN/CH3 (C24_CH3.2 R8_CH3.2)
NetC24_CH4_2: Input Subsystem (U6.10), IN/CH4 (C24_CH4.2 R8_CH4.2)
NetD1_2: Industrial Instrumentation Controller (J1.2), Power Subsystem (D1.2)
NetD2_2: Industrial Instrumentation Controller (P1.11), Power Subsystem (D2.2)
NetF1_CH1_1: Industrial Instrumentation Controller (TB1.1), IN/CH1 (F1_CH1.1)
NetF1_CH2_1: Industrial Instrumentation Controller (TB1.5), IN/CH2 (F1_CH2.1)
NetF1_CH3_1: Industrial Instrumentation Controller (TB1.9), IN/CH3 (F1_CH3.1)
NetF1_CH4_1: Industrial Instrumentation Controller (TB1.13), IN/CH4 (F1_CH4.1)
NetP1_1: Industrial Instrumentation Controller (P1.1), Input Subsystem (R11.2)
NetP1_2: Industrial Instrumentation Controller (P1.2), Input Subsystem (U8.2)
NetP1_3: Industrial Instrumentation Controller (P1.3), Input Subsystem (R12.2)
NetP1_4: Industrial Instrumentation Controller (P1.4), Input Subsystem (U9.2)
NetP1_5: Industrial Instrumentation Controller (P1.5), Input Subsystem (R13.2)
NetP1_6: Industrial Instrumentation Controller (P1.6), Input Subsystem (U10.2)
NetP1_7: Industrial Instrumentation Controller (P1.7), Input Subsystem (R9.2)
NetP1_8: Industrial Instrumentation Controller (P1.8), Input Subsystem (U7.2)